# Altium schematic sheet 5V2A schemat.SchDoc
size A0; SheetNumber: 3; SheetTotal: 3
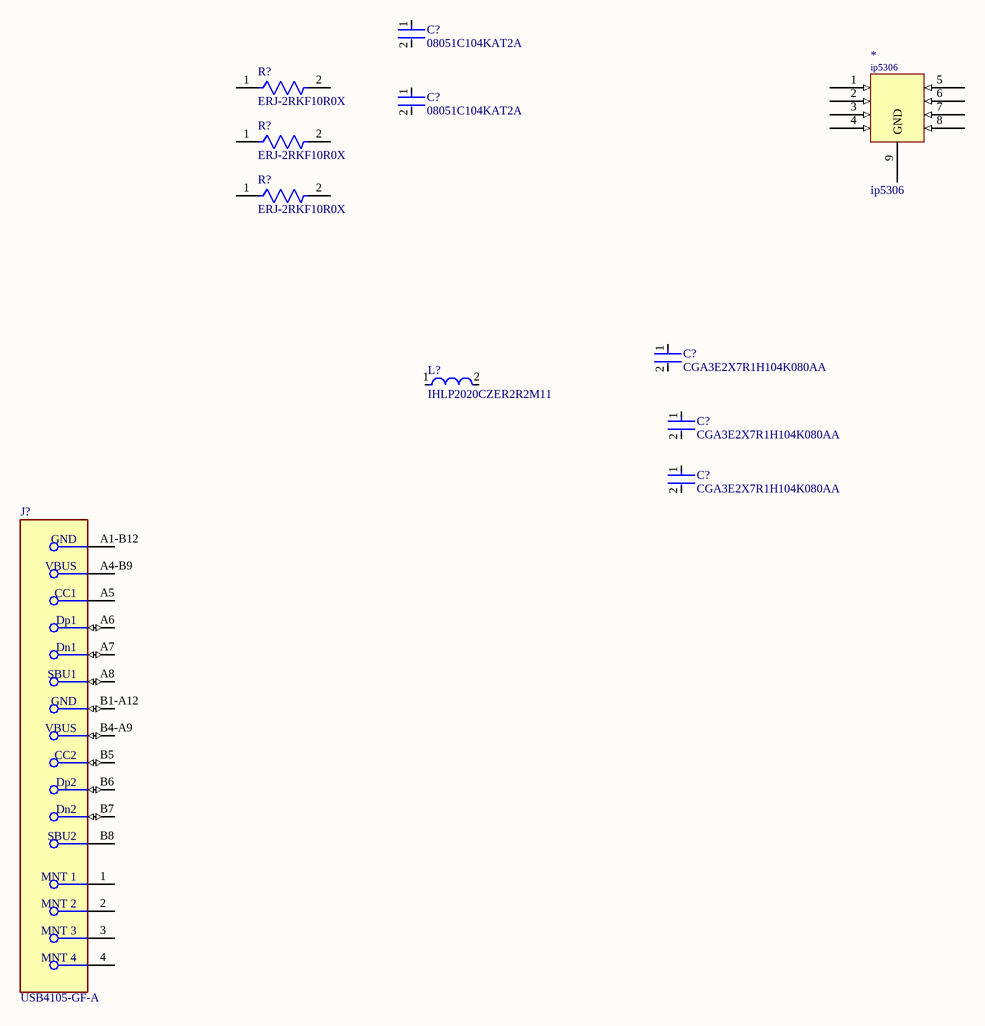
[diagram p0: 5V2A schemat.SchDoc]

## Parts
(Parts that share a designator on the sheet are numbered #1, #2 ... from top to bottom, then left to right.)
*  ip5306  [ip5306]
C?#1  08051C104KAT2A  [FP-0805-L_2_01_0_2-W_1_25-IPC_B]
C?#2  08051C104KAT2A  [FP-0805-L_2_01_0_2-W_1_25-IPC_B]
C?#3  CGA3E2X7R1H104K080AA  [FP-CGA3E-0_3-0_1-IPC_A]
C?#4  CGA3E2X7R1H104K080AA  [FP-CGA3E-0_3-0_1-IPC_A]
C?#5  CGA3E2X7R1H104K080AA  [FP-CGA3E-0_3-0_1-IPC_A]
J?  USB4105-GF-A  [FP-USB4105-GF-A-MFG]
L?  IHLP2020CZER2R2M11  [FP-IHLP-2020CZ-FP_1_905x2-MFG]
R?#1  ERJ-2RKF10R0X  [FP-ERJ2RK-MFG]
R?#2  ERJ-2RKF10R0X  [FP-ERJ2RK-MFG]
R?#3  ERJ-2RKF10R0X  [FP-ERJ2RK-MFG]

## Nets

Not connected (* = marked no-connect by the designer): * 1 2 3 4 5 6 7 8 9(GND); C?#1 1 2; C?#2 1 2; C?#3 1 2; C?#4 1 2; C?#5 1 2; J? 1(MNT_1) 2(MNT_2) 3(MNT_3) 4(MNT_4) A1-B12(GND) A4-B9(VBUS) A5(CC1) A6(Dp1) A7(Dn1) A8(SBU1) B1-A12(GND) B4-A9(VBUS) B5(CC2) B6(Dp2) B7(Dn2) B8(SBU2); L? 1 2; R?#1 1 2; R?#2 1 2; R?#3 1 2

## Library data of the parts
C?#1 C?#2 = CMP-2007-04174-2: General Purpose Ceramic Capacitor, 0805, 100nF, 10%, X7R, 15%, 100V; Packaging: Tape and Reel; Min Operating Temperature: -55°C; Dielectric Material: Ceramic; Height: 1.4mm; Voltage Rating: 100V; Termination: SMD/SMT; Case Code (Imperial): 0805; Case Code (Metric): 2012; Case/Package: 0805; Construction: Flat; Radiation Hardening: No; Series: -; Dielectric: X7R; Package Quantity: 2000; Mount: Surface Mount; Capacitance: 100nF; Contact Plating: Tin; Voltage: 100V; Lead Free: Lead Free; Depth: 1.25mm; RoHS Compliant: Yes; Number of Pins: 2; Max Operating Temperature: 125°C; Length: 2.01mm; Voltage Rating (DC): 100V; Thickness: 0.055inch; REACH SVHC: No SVHC; Width: 0.049inch; Tolerance: 10%
C?#3-C?#5 = CMP-2000-07546-2: Cap Ceramic 100nF 50V X7R 10% Pad SMD 0603 +125°C Automotive T/R; Weight: 7.1E-05oz; Composition: Ceramic; Max Operating Temperature: 125°C; Termination: SMD/SMT; Dielectric: X7R; Length: 1.6mm; Package Quantity: 1; REACH SVHC: No SVHC; Lead Free: Lead Free; Case Code (Metric): 1608; Min Operating Temperature: -55°C; Packaging: Tape and Reel; Tolerance: 10%; Voltage Rating: 50V; Case Code (Imperial): 0603; Capacitance: 100nF; Case/Package: 0603; Voltage Rating (DC): 50V; Depth: 0.8mm; Radiation Hardening: No; Ratings: AEC-Q200; Mount: Surface Mount; Voltage: 50V; Thickness: 0.035inch; Width: 0.8mm; Height: 0.8mm
J? = CMP-245163-000001-1: CONN RCPT USB2.0 TYPEC 5A; Manufacturer: GCT; Voltage Rating: 20V; Is Female: yes; Current Rating: 5/6.25/1.25/0.25A; Number Of Contacts: 16; Conn Orientation: Right Angle; Device Class L1: Connectors; Category: Conn; Lead Free: Yes; RoHS: TRUE; Temperature Range High: +85°C; Digikey Description: CONN RCPT USB2.0 TYPEC 5A; Device Class L3: unset; ComponentLink2Description: Datasheet; Manufacturer Part Number: USB4105-GF-A; Package: 0; Usb Standard: USB 2.0; Device Class L2: USB Connectors; Automotive: No; Temperature Range Low: -40°C; Height: 3.46mm; Temperature: -40°C to +85°C; Contact Material: Gold,Nickel; ComponentLink2URL: https://gct.co/files/drawings/usb4105.pdf; Octopart: https://octopart.com/usb4105-gf-a-gct-106627878
L? = CMP-02424-000234-1: Fixed Inductors Commercial Low DCR Series 2.2uH 6.75A 25mΩ 20%; Self Resonant Frequency: 41MHz; Saturation Current: 5.5A; Shielding: Shielded; Test Frequency: 100kHz; Core Material: Metal; DC Resistance (DCR): 25mR; Package Quantity: 2000; Current Rating: 6.75A; Lead Free: Lead Free; Max Operating Temperature: 125°C; Inductance: 2.2uH; Packaging: Tape and Reel; Inductance Tolerance: 20%; Height: 3mm; Mount: Surface Mount; Tolerance: 20%; Height - Seated (Max): 0.118inch; Max DC Current: 5.5A; Length: 5.74mm; Termination: SMD/SMT; Contact Plating: Tin; RMS Current (Irms): 6.75A; Width: 0.204inch; Radiation Hardening: No; Case/Package: 2020; Military Standard: Not; Depth: 5.43mm; Min Operating Temperature: -55°C
R?#1-R?#3 = CMP-2002-00622-4: RES SMD 10 OHM 1% 1/10W 0402; Manufacturer: Panasonic; Power Rating: 0.1W; Value: 10Ω; Automotive Grade: Grade 0; Temperature Coefficient: 100ppm/°C; Voltage Rating: 50V; Octopart: https://octopart.com/erj-2rkf10r0x-panasonic-55404982; Digikey Description: RES SMD 10 OHM 1% 1/10W 0402; Mouser Description: Thick Film Resistors - SMD 0402 10.0ohms 1% Tol AEC-Q200; Series: ERJ; Temperature Range High: +155°C; ComponentLink2Description: Datasheet; Tolerance: 1%; Manufacturer Part Number: ERJ-2RKF10R0X; Temperature Range Low: -55°C; RoHS: TRUE; Footprint Url: https://industrial.panasonic.com/cdbs/www-data/pdf/RDA0000/DMA0000COL17.pdf; Lead Free: Yes; Device Class L2: Resistors; ComponentLink2URL: https://industrial.panasonic.com/cdbs/www-data/pdf/RDA0000/AOA0000C304.pdf; Height: 0.4mm; Device Class L3: Chip SMD Resistors; Device Class L1: Passive Components; Automotive: Yes; Resistance: 10Ω; Category: Res; Temperature: -55°C to +155°C; Composition: Thick Film; Package: ERJ2RK